# Altium schematic sheet DiffEncoder.SchDoc
size A4; SheetNumber: 3; SheetTotal: 4
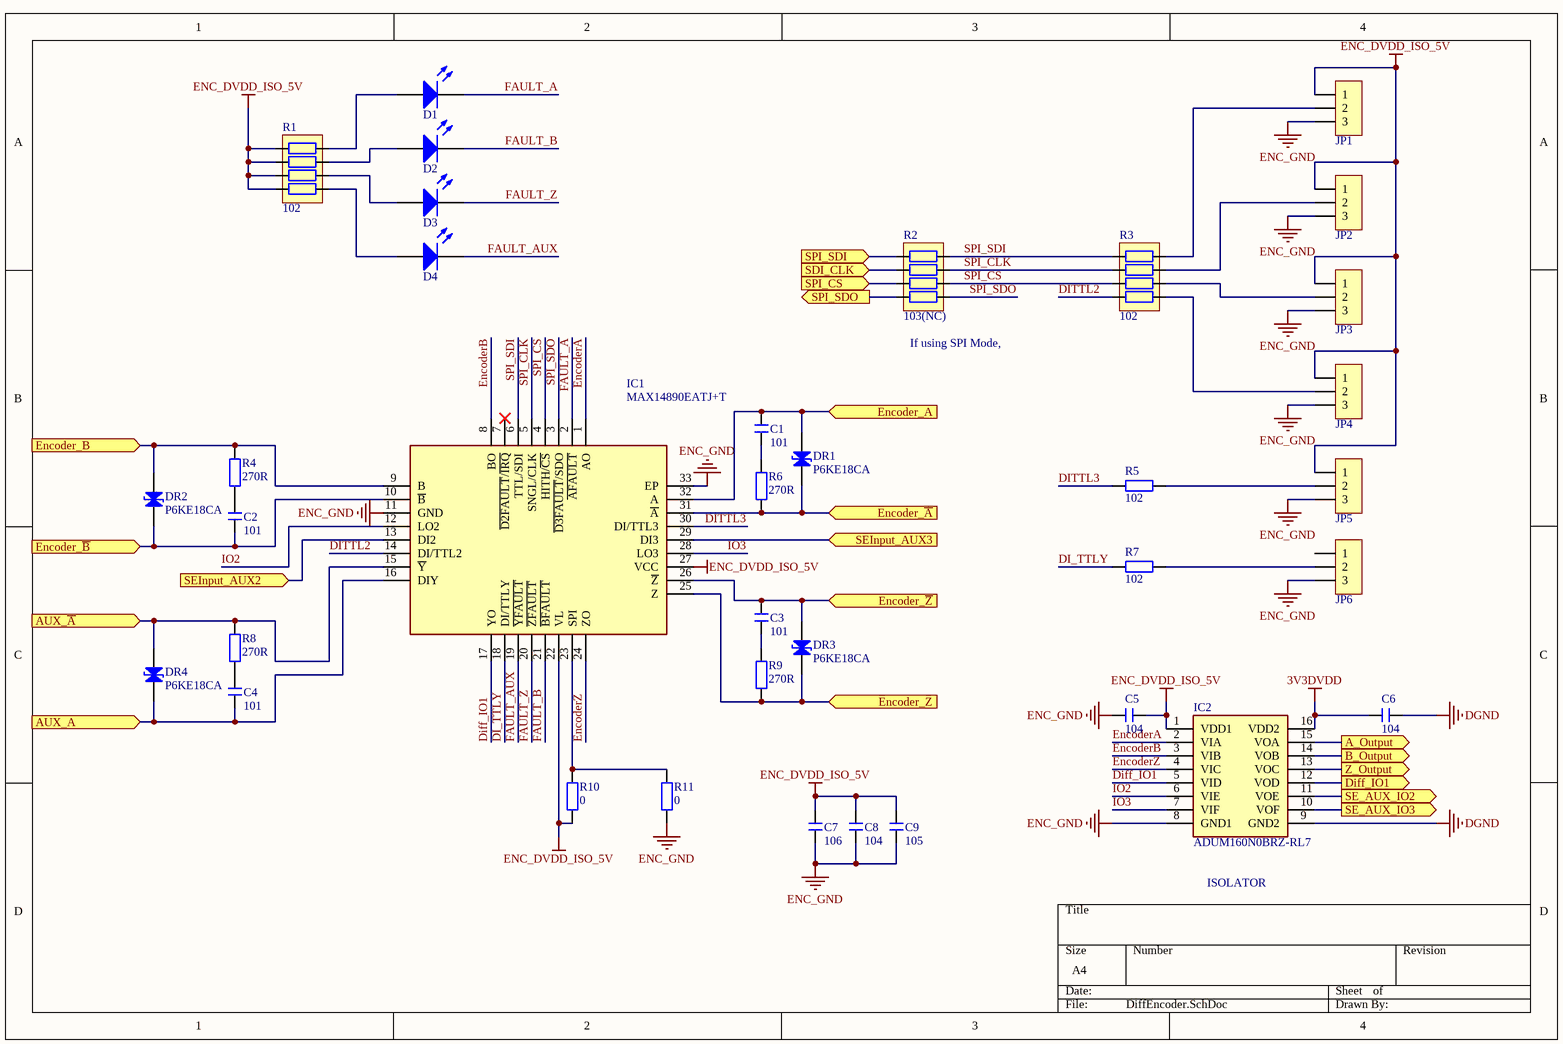
[diagram p0: DiffEncoder.SchDoc]

## Parts
C1  101  [C 0603_L]
C2  101  [C 0603_L]
C3  101  [C 0603_L]
C4  101  [C 0603_L]
C5  104  [C 0603_L]
C6  104  [C 0603_L]
C7  106  [C 0603_L]
C8  104  [C 0603_L]
C9  105  [C 0603_L]
D1  LED  [LED 0603W]  (value not drawn)
D2  LED  [LED 0603W]  (value not drawn)
D3  LED  [LED 0603W]  (value not drawn)
D4  LED  [LED 0603W]  (value not drawn)
DR1  P6KE18CA  [SMA]
DR2  P6KE18CA  [SMA]
DR3  P6KE18CA  [SMA]
DR4  P6KE18CA  [SMA]
IC1  MAX14890EATJ+T  [QFN50P500X500X80-33N]
IC2  ADUM160N0BRZ-RL7  [SOIC127P600X175-16N]
JP1  HDR-1X3  [HDR2.54-LI-3P]  (value not drawn)
JP2  HDR-1X3  [HDR2.54-LI-3P]  (value not drawn)
JP3  HDR-1X3  [HDR2.54-LI-3P]  (value not drawn)
JP4  HDR-1X3  [HDR2.54-LI-3P]  (value not drawn)
JP5  HDR-1X3  [HDR2.54-LI-3P]  (value not drawn)
JP6  HDR-1X3  [HDR2.54-LI-3P]  (value not drawn)
R1  102  [RCA-8P4R-0603]
R2  103(NC)  [RCA-8P4R-0603]
R3  102  [RCA-8P4R-0603]
R4  270R  [R 0603_L]
R5  102  [R 0603_L]
R6  270R  [R 0603_L]
R7  102  [R 0603_L]
R8  270R  [R 0603_L]
R9  270R  [R 0603_L]
R10  0  [R 0603_L]
R11  0  [R 0603_L]

## Ports
A_Output (out), AUX_A (in), AUX_~{A} (in), B_Output (out), Diff_IO1 (out), Encoder_A (in), Encoder_B (in), Encoder_Z (in), Encoder_~{A} (in), Encoder_~{B} (in), Encoder_~{Z} (in), SDI_CLK (in), SE_AUX_IO2 (out), SE_AUX_IO3 (out), SEInput_AUX2 (in), SEInput_AUX3 (in), SPI_CS (in), SPI_SDI (in), SPI_SDO (out), Z_Output (out)

## Nets
3V3DVDD: C6.2 IC2.16(VDD2)
DGND: C6.1 IC2.9(GND2)
ENC_DVDD_ISO_5V: C5.1 C7.2 C8.2 C9.2 IC1.22(VL) IC1.27(VCC) IC2.1(VDD1) JP1.1 JP2.1 JP3.1 JP4.1 JP5.1 R1.1 R1.2 R1.3 R1.4 R10.1
ENC_GND: C5.2 C7.1 C8.1 C9.1 IC1.11(GND) IC1.33(EP) IC2.8(GND1) JP1.3 JP2.3 JP3.3 JP4.3 JP5.3 JP6.3 R11.2
A_Output: IC2.15(VOA) ; port A_Output
AUX_A: C4.1 DR4.2(K) IC1.16(DIY) ; port AUX_A
AUX_~{A}: DR4.1(A) IC1.15(~{Y}) R8.2 ; port AUX_~{A}
B_Output: IC2.14(VOB) ; port B_Output
DI_TTLY: IC1.18(DI/TTLY) R7.1
Diff_IO1: IC1.17(YO) IC2.5(VID)
Diff_IO1: IC2.12(VOD) ; port Diff_IO1  [a separate net that carries the same name]
DITTL2: IC1.14(DI/TTL2) R3.4
DITTL3: IC1.30(DI/TTL3) R5.1
Encoder_A: C1.1 DR1.1(A) IC1.32(A) ; port Encoder_A
Encoder_~{A}: DR1.2(K) IC1.31(~{A}) R6.2 ; port Encoder_~{A}
Encoder_B: DR2.1(A) IC1.9(B) R4.2 ; port Encoder_B
Encoder_~{B}: C2.1 DR2.2(K) IC1.10(~{B}) ; port Encoder_~{B}
Encoder_Z: DR3.2(K) IC1.25(Z) R9.2 ; port Encoder_Z
Encoder_~{Z}: C3.1 DR3.1(A) IC1.26(~{Z}) ; port Encoder_~{Z}
EncoderA: IC1.1(AO) IC2.2(VIA)
EncoderB: IC1.8(BO) IC2.3(VIB)
EncoderZ: IC1.24(ZO) IC2.4(VIC)
FAULT_A: D1.2(K) IC1.2(~{AFAULT})
FAULT_AUX: D4.2(K) IC1.19(~{YFAULT})
FAULT_B: D2.2(K) IC1.21(~{BFAULT})
FAULT_Z: D3.2(K) IC1.20(~{ZFAULT})
IO2: IC1.12(LO2) IC2.6(VIE)
IO3: IC1.28(LO3) IC2.7(VIF)
SDI_CLK: R2.2 ; port SDI_CLK
SE_AUX_IO2: IC2.11(VOE) ; port SE_AUX_IO2
SE_AUX_IO3: IC2.10(VOF) ; port SE_AUX_IO3
SEInput_AUX2: IC1.13(DI2) ; port SEInput_AUX2
SEInput_AUX3: IC1.29(DI3) ; port SEInput_AUX3
SPI_CLK: IC1.5(SNGL/CLK) R2.7 R3.2
SPI_CS: IC1.4(HITH/~{CS}) R2.6 R3.3
SPI_CS: R2.3 ; port SPI_CS  [a separate net that carries the same name]
SPI_SDI: IC1.6(TTL/SDI) R2.8 R3.1
SPI_SDI: R2.1 ; port SPI_SDI  [a separate net that carries the same name]
SPI_SDO: IC1.3(~{D3FAULT}/SDO) R2.5
SPI_SDO: R2.4 ; port SPI_SDO  [a separate net that carries the same name]
Z_Output: IC2.13(VOC) ; port Z_Output
NetC1_2: C1.2 R6.1
NetC2_2: C2.2 R4.1
NetC3_2: C3.2 R9.1
NetC4_2: C4.2 R8.1
NetD1_1: D1.1(A) R1.8
NetD2_1: D2.1(A) R1.7
NetD3_1: D3.1(A) R1.6
NetD4_1: D4.1(A) R1.5
NetIC1_23: IC1.23(SPI) R10.2 R11.1
NetJP1_2: JP1.2 R3.8
NetJP2_2: JP2.2 R3.7
NetJP3_2: JP3.2 R3.6
NetJP4_2: JP4.2 R3.5
NetJP5_2: JP5.2 R5.2
NetJP6_2: JP6.2 R7.2

Not connected (* = marked no-connect by the designer): IC1 7(~{D2FAULT}/~{IRQ})*; JP6 1

## Notes on the sheet
- (near R2) If using SPI Mode,
- ISOLATOR

## Library data of the parts
C1-C9 = C: 贴片电容; BOM名称: 无极性贴片电容; 淘宝ID: 封装库来自淘宝 ID：黄晶宝石; 联系售后，技术支持: https://shop463601444.taobao.com; 唯一出售店铺网址: https://shop463601444.taobao.com
D1-D4 = LED: 发光二极管; 技术支持，联系售后: https://shop463601444.taobao.com
DR1-DR4 = DR: 瞬态电压抑制二极管; 版权归属: 封装库来自淘宝 ID：黄晶宝石; BOM名称: 瞬态电压抑制二极管; 学习资源: https://shop463601444.taobao.com
IC1 = MAX14890EATJ+T: Integrated Circuit; Manufacturer_Name: Analog Devices; Datasheet Link: https://datasheets.maximintegrated.com/en/ds/MAX14890E.pdf; Height: 0.8mm; Manufacturer_Part_Number: MAX14890EATJ+T; Mouser Part Number: 700-MAX14890EATJ+T; Mouser Price/Stock: https://www.mouser.co.uk/ProductDetail/Analog-Devices-Maxim-Integrated/MAX14890EATJ%2bT?qs=OAQKEzuI%2F894x6Nfk0wCQA%3D%3D
IC2 = ADUM160N0BRZ-RL7: Integrated Circuit; Manufacturer_Name: Analog Devices; Datasheet Link: https://www.analog.com/media/en/technical-documentation/data-sheets/adum160n-161n-162n-163n.pdf; Height: 1.75mm; Manufacturer_Part_Number: ADUM160N0BRZ-RL7; Mouser Part Number: 584-ADUM160N0BRZ-RL7; Mouser Price/Stock: https://www.mouser.co.uk/ProductDetail/Analog-Devices/ADUM160N0BRZ-RL7?qs=cslStgdnz9OW1mXsMBZKfA%3D%3D; Arrow Part Number: ADUM160N0BRZ-RL7; Arrow Price/Stock: https://www.arrow.com/en/products/adum160n0brz-rl7/analog-devices
JP1-JP6 = Header 3: 3P接插件; 版权归属: 封装库来自淘宝 ID：黄晶宝石; BOM名称: 3P接插件; 学习资源: https://shop463601444.taobao.com
R1-R3 = R-8P4R: 贴片排阻; BOM名称: 贴片网络排阻; 版权归属: 封装库来自淘宝 ID：黄晶宝石; 联系售后: https://shop463601444.taobao.com
R4-R11 = R: 贴片电阻; 版权归属: 来自淘宝 ID：黄晶宝石; 封装库来自淘宝卖家 ID：黄晶宝石: 其他店铺购入均为盗版，不享受售后技术支持服务，请立即申请退款; BOM名称: 贴片电阻; 联系售后: https://shop463601444.taobao.com